# EAGLE design Controller Board v7 (EAGLE 5.06)
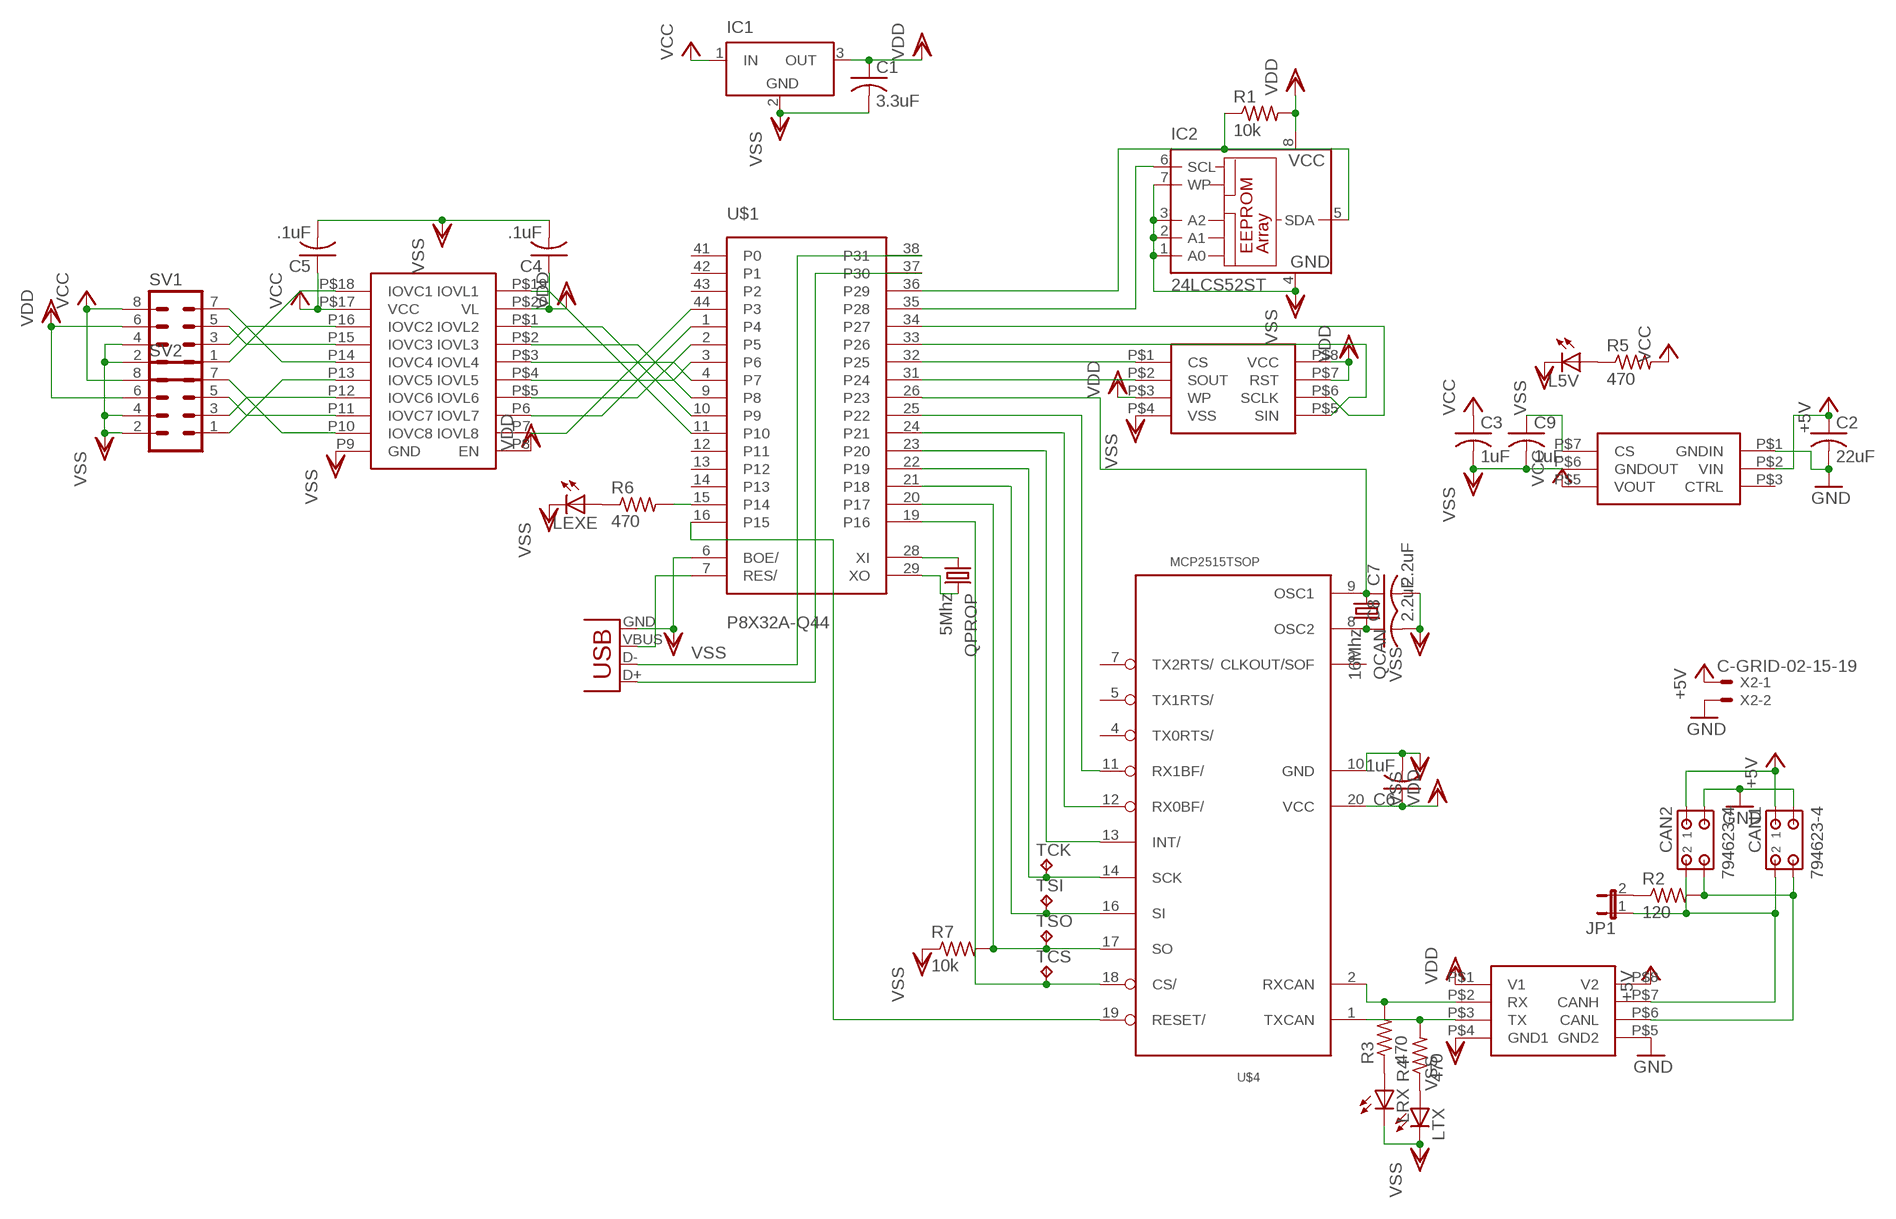
[diagram p0: schematic, sheet 1]

## Parts
C1  3.3uF  C-USC0805  [C0805]
C2  22uF  C-USC1210  [C1210]
C3  1uF  C-USC1210  [C1210]
C4  .1uF  C-USC0805  [C0805]
C5  .1uF  C-USC0805  [C0805]
C6  1uF  C-USC0805  [C0805]
C7  2.2uF  C-USC0805  [C0805]
C8  2.2uF  C-USC0805  [C0805]
C9  1uF  C-USC1210  [C1210]
CAN1  794623-4  [794623-4]
CAN2  794623-4  [794623-4]
IC1  LT1129CST5  [SOT223]
IC2  24LCS52ST  [TSSOP8]
JP1  JP1E  [JP1]
L5V  LEDCHIP-LED0805  [CHIP-LED0805]
LEXE  LEDCHIP-LED0805  [CHIP-LED0805]
LRX  LEDCHIP-LED0805  [CHIP-LED0805]
LTX  LEDCHIP-LED0805  [CHIP-LED0805]
QCAN  16Mhz  CRYSTALHC49UP  [HC49UP]
QPROP  5Mhz  CRYSTALHC49UP  [HC49UP]
R1  10k  R-US_R0603  [R0603]
R2  120  R-US_R0603  [R0603]
R3  470  R-US_R0603  [R0603]
R4  470  R-US_R0603  [R0603]
R5  470  R-US_R0603  [R0603]
R6  470  R-US_R0603  [R0603]
R7  10k  R-US_R0603  [R0603]
SV1  MA04-2  [MA04-2]
SV2  MA04-2  [MA04-2]
TCK  TPPAD1-13  [P1-13]
TCS  TPPAD1-13  [P1-13]
TSI  TPPAD1-13  [P1-13]
TSO  TPPAD1-13  [P1-13]
U$1  P8X32A-Q44  [P8X32A-Q44]
U$2  VINF-VWRBS2  [VINF-VWRBS2]
U$3  TI-ISO1050  [DUB-8]
U$4  MCP2515TSOP  [TSSOP20]
U$5  M25PE20  [S08N]
U$6  MAX3000E  [TQFN-20]
X1  USBSMD  [USB-MINIB]
X2  C-GRID-02-15-19  [15-91-02]

## Nets
+5V: C2.1 CAN1.1 CAN2.1 U$2.P$2(VIN) U$3.P$8(V2) X2.1
FLASHCLK: U$1.34(P27) U$5.P$6(SCLK)
FLASHSIN: U$1.33(P26) U$5.P$5(SIN)
GND: C2.2 CAN1.3 CAN2.3 U$2.P$1(GNDIN) U$3.P$5(GND2) X2.2
N$1: QPROP.1 U$1.28(XI)
N$2: QPROP.2 U$1.29(XO)
N$3: IC2.6(SCL) U$1.35(P28)
N$4: IC2.5(SDA) R1.1 U$1.36(P29)
N$5: U$1.7(RES/) X1.VBUS
N$6: U$1.38(P31) X1.D-
N$7: U$1.37(P30) X1.D+
N$8: U$1.25(P22) U$4.11(RX1BF/)
N$9: U$1.24(P21) U$4.12(RX0BF/)
N$10: CAN1.4 CAN2.4 R2.2 U$3.P$6(CANL)
N$11: CAN1.2 CAN2.2 JP1.1 U$3.P$7(CANH)
N$12: R6.2 U$1.15(P14)
N$13: C9.1 U$2.P$7(CS)
N$14: U$1.32(P25) U$5.P$1(CS)
N$15: U$1.31(P24) U$5.P$2(SOUT)
N$16: U$1.23(P20) U$4.13(INT/)
N$17: TCK.1(TP) U$1.22(P19) U$4.14(SCK)
N$18: C7.1 QCAN.1 U$1.26(P23) U$4.9(OSC1)
N$19: C8.1 QCAN.2 U$4.8(OSC2)
N$20: R3.2 U$3.P$2(RX) U$4.2(RXCAN)
N$21: R4.2 U$3.P$3(TX) U$4.1(TXCAN)
N$22: JP1.2 R2.1
N$23: TSI.1(TP) U$1.21(P18) U$4.16(SI)
N$24: TCS.1(TP) U$1.19(P16) U$4.18(CS/)
N$25: U$1.16(P15) U$4.19(RESET/)
N$26: LRX.A R3.1
N$27: U$1.11(P10) U$6.P$19(IOVL1)
N$28: SV2.7 U$6.P10(IOVC8)
N$29: SV2.5 U$6.P11(IOVC7)
N$30: U$1.10(P9) U$6.P$1(IOVL2)
N$31: U$1.9(P8) U$6.P$2(IOVL3)
N$32: U$1.4(P7) U$6.P$3(IOVL4)
N$33: U$1.3(P6) U$6.P$4(IOVL5)
N$34: U$1.2(P5) U$6.P$5(IOVL6)
N$35: U$1.1(P4) U$6.P6(IOVL7)
N$36: U$1.44(P3) U$6.P7(IOVL8)
N$37: SV2.3 U$6.P12(IOVC6)
N$38: SV2.1 U$6.P13(IOVC5)
N$39: SV1.7 U$6.P14(IOVC4)
N$40: SV1.1 U$6.P$18(IOVC1)
N$41: SV1.3 U$6.P16(IOVC2)
N$42: SV1.5 U$6.P15(IOVC3)
N$44: R7.2 TSO.1(TP) U$1.20(P17) U$4.17(SO)
N$46: LTX.A R4.1
N$47: L5V.A R5.1
N$48: LEXE.A R6.1
VCC: C3.1 C5.1 IC1.1(IN) R5.2 SV1.8 SV2.8 U$2.P$5(VOUT) U$6.P$17(VCC)
VDD: C1.1 C4.1 C6.1 IC1.3(OUT) IC2.8(VCC) R1.2 SV1.6 SV2.6 U$3.P$1(V1) U$4.20(VCC) U$5.P$3(WP) U$5.P$7(RST) U$5.P$8(VCC) U$6.P8(EN) U$6.P$20(VL)
VSS: C1.2 C3.2 C4.2 C5.2 C6.2 C7.2 C8.2 C9.2 IC1.2(GND) IC2.1(A0) IC2.2(A1) IC2.3(A2) IC2.4(GND) IC2.7(WP) L5V.C LEXE.C LRX.C LTX.C R7.1 SV1.2 SV1.4 SV2.2 SV2.4 U$1.6(BOE/) U$2.P$6(GNDOUT) U$3.P$4(GND1) U$4.10(GND) U$5.P$4(VSS) U$6.P9(GND) X1.GND
Unconnected: U$1.12(P11) U$1.13(P12) U$1.14(P13) U$1.41(P0) U$1.42(P1) U$1.43(P2) U$2.P$3(CTRL) U$4.3(CLKOUT/SOF) U$4.4(TX0RTS/) U$4.5(TX1RTS/) U$4.7(TX2RTS/)

## Power pins joined to a net without a drawn wire
VDD: U$1.8(VDD) U$1.18(VDD) U$1.30(VDD) U$1.40(VDD)
VSS: IC1.4(GND) U$1.5(VSS) U$1.17(VSS) U$1.27(VSS) U$1.39(VSS)

## Library data of the parts
C1-C9 = rcl:C-US: CAPACITOR, American symbol
CAN1 CAN2 = con-amp:794623-4: MICRO MATE N LOK Dual Row, grid 1.5 mm Source: http://catalog.tycoelectronics.com .. ENG_CD_794623_F.pdf
IC1 = linear-technology:LT1129CST5: VOLTAGE REGULATOR with shutdown
IC2 = microchip:24*: Serial EEPROM I2C
JP1 = jumper:JP1E: JUMPER
L5V LEXE LRX LTX = led:LED: LED OSRAM: - CHIPLED LG R971, LG N971, LY N971, LG Q971, LY Q971, LO R971, LY R971 LH N974, LH R974 LS Q976, LO Q976, LY Q976 LO Q996 - Hyper CHIPLED LW Q18S LB Q993, LB Q99A, LB R99A - SideLED LS A670, LO A670, LY A670, LG A670, LP A670 LB A673, LV A673, LT A673, LW A673 LH A674 LY A675 LS A676, LA A676, LO A676, LY A676, LW A676 LS A679, LY A679, LG A679 - Hyper Micro SIDELED® LS Y876, LA Y876, LO Y876, LY Y876 LT Y87S - SmartLED LW L88C, LW L88S LB L89C, LB L89S, LG L890 LS L89K, LO L89K, LY L89K LS L896, LA L896, LO L896, LY L896 - TOPLED LS T670, LO T670, LY T670, LG T670, LP T670 LSG T670, LSP T670, LSY T670, LOP T670, LYG T670 LG T671, LOG T671, LSG T671 LB T673, LV T673, LT T673, LW T673 LH T674 LS T676, LA T676, LO T676, LY T676, LB T676, LH T676, LSB T676, LW T676 LB T67C, LV T67C, LT T67C, LS T67K, LO T67K, LY T67K, LW E67C LS E67B, LA E67B, LO E67B, LY E67B, LB E67C, LV E67C, LT E67C LW T67C LS T679, LY T679, LG T679 LS T770, LO T770, LY T770, LG T770, LP T770 LB T773, LV T773, LT T773, LW T773 LH T774 LS E675, LA E675, LY E675, LS T675 LS T776, LA T776, LO T776, LY T776, LB T776 LHGB T686 LT T68C, LB T68C - Hyper Mini TOPLED® LB M676 - Mini TOPLED Santana® LG M470 LS M47K, LO M47K, LY M47K Source: http://www.osram.convergy.de LUXEON: - LUMILED® LXK2-PW12-R00, LXK2-PW12-S00, LXK2-PW14-U00, LXK2-PW14-V00 LXK2-PM12-R00, LXK2-PM12-S00, LXK2-PM14-U00 LXK2-PE12-Q00, LXK2-PE12-R00, LXK2-PE12-S00, LXK2-PE14-T00, LXK2-PE14-U00 LXK2-PB12-K00, LXK2-PB12-L00, LXK2-PB12-M00, LXK2-PB14-N00, LXK2-PB14-P00, LXK2-PB14-Q00 LXK2-PR12-L00, LXK2-PR12-M00, LXK2-PR14-Q00, LXK2-PR14-R00 LXK2-PD12-Q00, LXK2-PD12-R00, LXK2-PD12-S00 LXK2-PH12-R00, LXK2-PH12-S00 LXK2-PL12-P00, LXK2-PL12-Q00, LXK2-PL12-R00 Source: www.luxeon.com KINGBRIGHT: KA-3528ASYC Source: www.kingbright.com
QCAN QPROP = crystal:CRYSTAL: CRYSTAL
R1-R7 = rcl:R-US_: RESISTOR, American symbol
SV1 SV2 = con-lstb:MA04-2: PIN HEADER
TCK TCS TSI TSO = testpad:TP: Test pad
U$1 = parallax_propeller:P8X32A-Q44
U$2 = dc-dc-converter:VINF-VWRBS2
U$3 = isodcdc:TI-ISO1050
U$4 = MCP2515_MT:MCP2515*: MCP2515 Standalone CAN-Controller by Microchip Eagle-Lib. by MartinThomas
U$5 = Flash:M25PE20
U$6 = Level Shifters:MAX3000E
X1 = SparkFun:USB: USB Connectors USB-B-PTH is fully proven SKU : PRT-00139 USB-miniB is fully proven SKU : PRT-00587 USB-A-PCB is untested. USB-A-H is throughly reviewed, but untested. Spark Fun Electronics SKU : PRT-00437 USB-B-SMT is throughly reviewed, but untested. Needs silkscreen touching up. USB-A-S has not been used/tested USB-MB-H has not been used/tested
X2 = con-molex:C-GRID-02: CONNECTOR wire to board 2.54 mm (0.100") pitch header

## Board
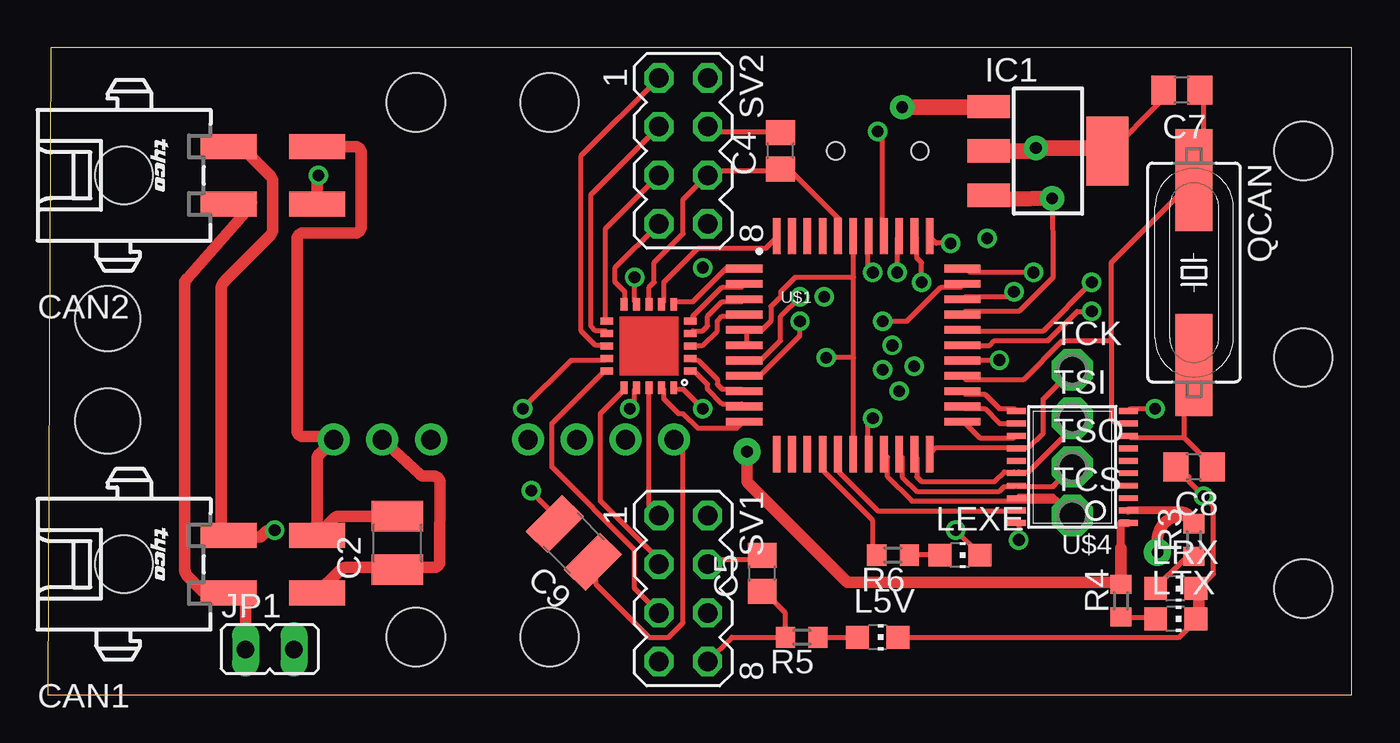
[diagram p1: board, top side]
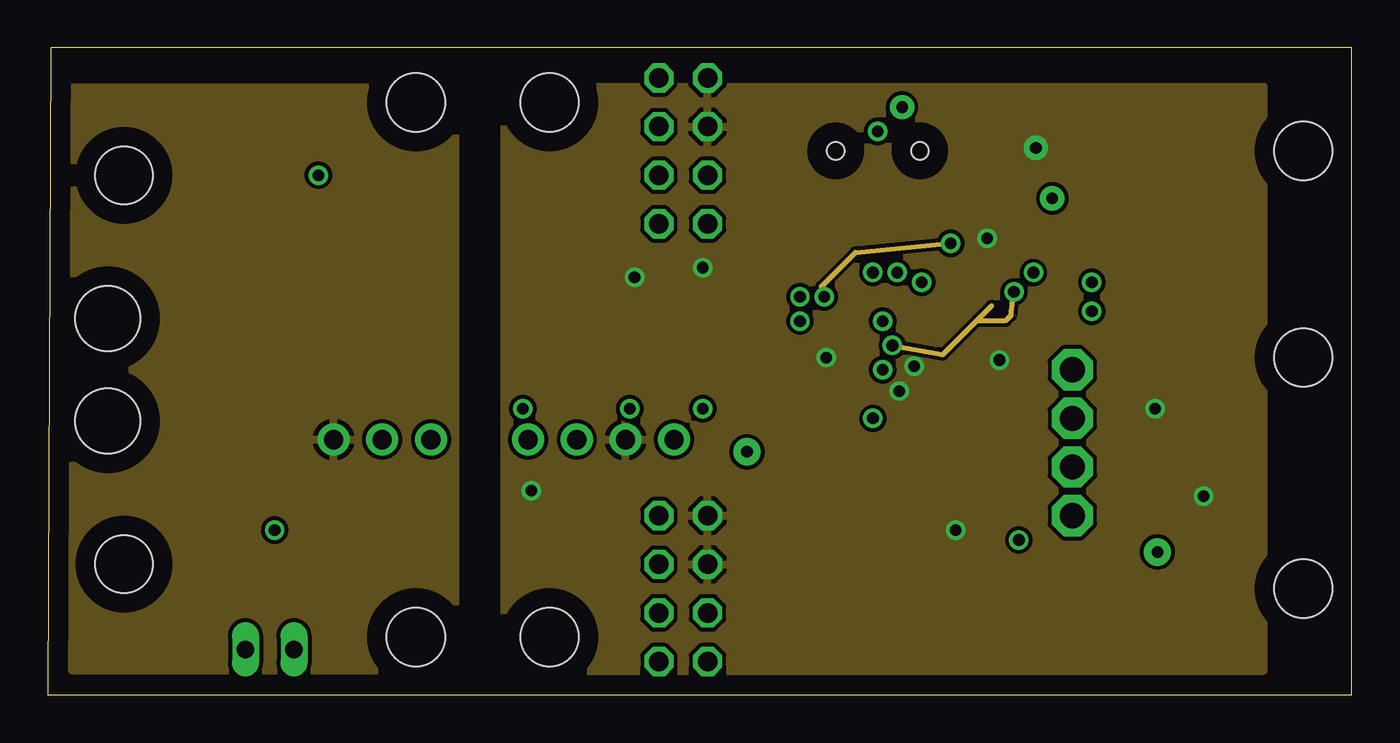
[diagram p2: board, inner layer Route2]
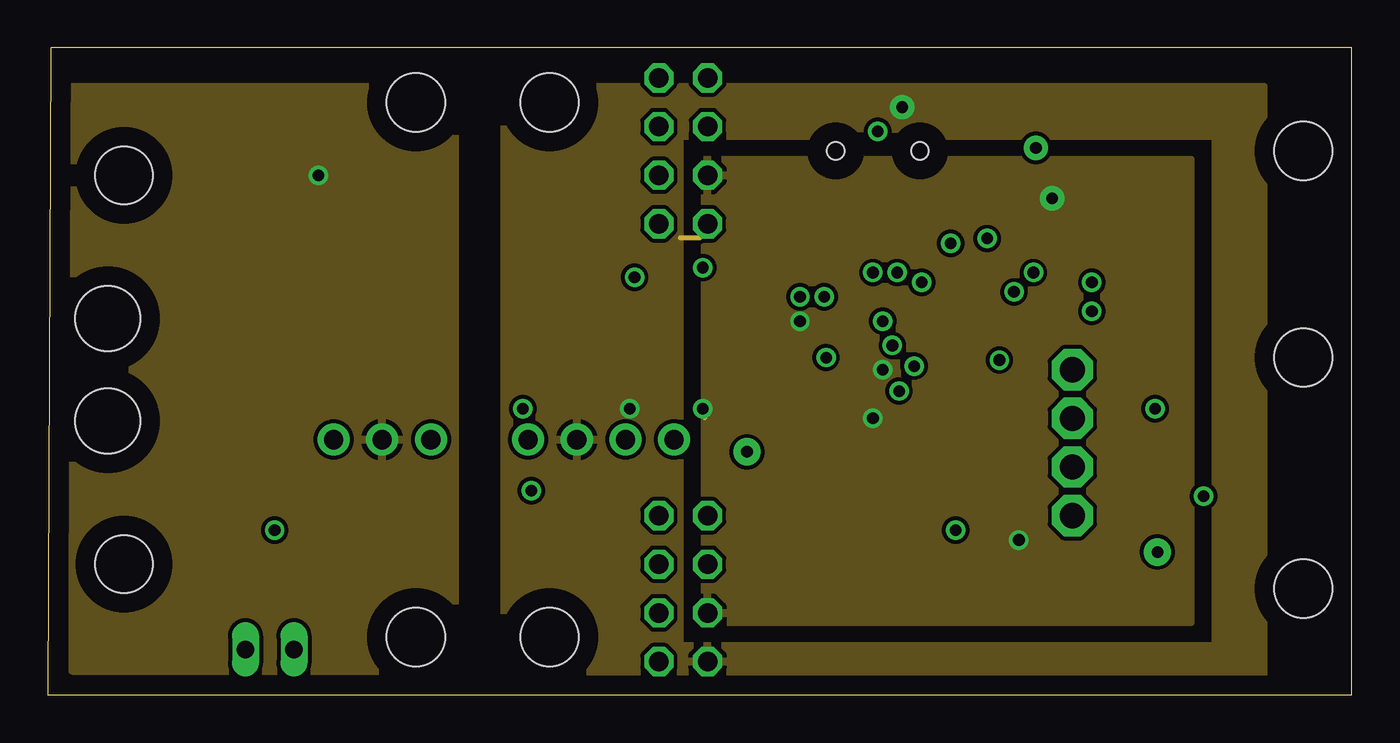
[diagram p3: board, inner layer Route15]
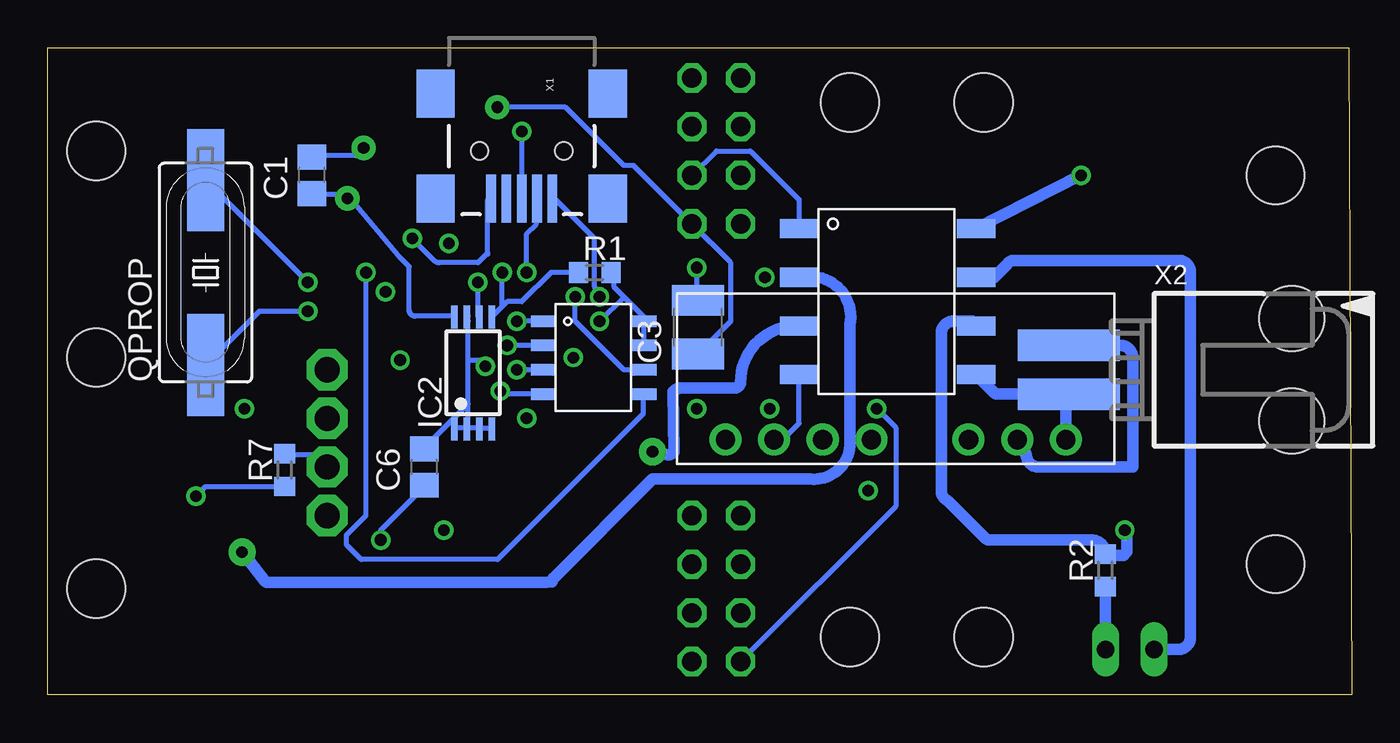
[diagram p4: board, bottom side, seen from below]

Size 68.08 x 33.8 mm. Coordinates in mm from the lower left corner, seen from the top.
Outline: 0,0 68.08,0 68.08,33.8 0.16,33.8 0,0
Copper layers (1*2+15*16): Top 0.035mm / dielectric 0.2mm / Route2 0.035mm / dielectric 1.5mm / Route15 0.035mm / dielectric 0.2mm / Bottom 0.035mm
Design rules "4 layer": minimum track width 10mil, minimum drill 24mil, track to track 8mil, track to pad 8mil, pad to pad 8mil, via to via 8mil, smd to smd 8mil, copper to edge 40mil, drill to drill 8mil, minimum pad ring 10mil, minimum via ring 8mil, stop-mask expansion 4mil, vias tented up to drill 0mil, thermal gap 10mil
Holes 3.05 mm at 65.56,5.56 65.56,28.42 26.19,30.96 26.19,3.02 65.56,17.62 19.21,30.96 19.21,3.02
tRestrict: area 22.4,4.3 to 23,30.3

### Footprints (pad centres in the part's own frame; a part is rotated, then mirrored left to right if it is on the bottom)
C0805 = smd 1.3 x 1.5: 1 -0.95,0; 2 0.95,0
C1210 = smd 1.6 x 2.7: 1 -1.4,0; 2 1.4,0
794623-4 = smd 1.3 x 2.92: 1 1.5,10.1; 2 1.5,5.48; 3 -1.5,10.1; 4 -1.5,5.48 | hole 3: 0,0
SOT223 = smd 1.219 x 2.235: 1 -2.311,-3.099; 2 0,-3.099; 3 2.311,-3.099 | smd 3.6 x 2.2: 4 0,3.099
TSSOP8 = smd 0.35 x 1.2: 1 -0.975,-2.925; 2 -0.325,-2.925; 3 0.325,-2.925; 4 0.975,-2.925; 5 0.975,2.925; 6 0.325,2.925; 7 -0.325,2.925; 8 -0.975,2.925
JP1 = drill 0.914 long: 1 0,-1.27; 2 0,1.27
CHIP-LED0805 = smd 1.2 x 1.2: A 0,-1.05; C 0,1.05
HC49UP = smd 5.334 x 1.93: 1 -4.826,0; 2 4.826,0
R0603 = smd 1 x 1.1: 1 -0.85,0; 2 0.85,0
MA04-2 = drill 1.016 octagon: 1 -3.81,-1.27; 2 -3.81,1.27; 3 -1.27,-1.27; 4 -1.27,1.27; 5 1.27,-1.27; 6 1.27,1.27; 7 3.81,-1.27; 8 3.81,1.27
P1-13 = drill 1.321 pad 2.159 octagon: 1 0,0
P8X32A-Q44 = smd 1.9 x 0.4: 1 -5.713,4.013; 2 -5.713,3.212; 3 -5.713,2.413; 4 -5.713,1.613; 5 -5.713,0.812; 6 -5.713,0.013; 7 -5.713,-0.787; 8 -5.713,-1.587; 9 -5.713,-2.388; 10 -5.713,-3.188; 11 -5.713,-3.987; 23 5.688,-3.987; 24 5.688,-3.188; 25 5.688,-2.388; 26 5.688,-1.587; 27 5.688,-0.787; 28 5.688,0.013; 29 5.688,0.812; 30 5.688,1.613; 31 5.688,2.413; 32 5.688,3.212; 33 5.688,4.013 | smd 0.4 x 1.9: 12 -4.013,-5.688; 13 -3.212,-5.688; 14 -2.413,-5.688; 15 -1.613,-5.688; 16 -0.812,-5.688; 17 -0.013,-5.688; 18 0.787,-5.688; 19 1.587,-5.688; 20 2.388,-5.688; 21 3.188,-5.688; 22 3.987,-5.688; 34 3.987,5.713; 35 3.188,5.713; 36 2.388,5.713; 37 1.587,5.713; 38 0.787,5.713; 39 -0.013,5.713; 40 -0.812,5.713; 41 -1.613,5.713; 42 -2.413,5.713; 43 -3.212,5.713; 44 -4.013,5.713
VINF-VWRBS2 = drill 1 pad 1.676 round: P$1 -12.7,5.08; P$2 -10.16,5.08; P$3 -7.62,5.08; P$4 -2.54,5.08; P$5 0,5.08; P$6 2.54,5.08; P$7 5.08,5.08
DUB-8 = smd 2 x 1: P$1 -4.572,3.556; P$2 -4.572,1.016; P$3 -4.572,-1.524; P$4 -4.572,-4.064; P$5 4.678,-4.064; P$6 4.678,-1.524; P$7 4.678,1.016; P$8 4.678,3.556
TSSOP20 = smd 0.305 x 0.991: 1 -2.925,-2.918; 2 -2.275,-2.918; 3 -1.625,-2.918; 4 -0.975,-2.918; 5 -0.325,-2.918; 6 0.325,-2.918; 7 0.975,-2.918; 8 1.625,-2.918; 9 2.275,-2.918; 10 2.925,-2.918; 11 2.925,2.918; 12 2.275,2.918; 13 1.625,2.918; 14 0.975,2.918; 15 0.325,2.918; 16 -0.325,2.918; 17 -0.975,2.918; 18 -1.625,2.918; 19 -2.275,2.918; 20 -2.925,2.918
S08N = smd 0.6 x 1.3: P$1 -2.54,-2.667; P$2 -1.27,-2.667; P$3 0,-2.667; P$4 1.27,-2.667; P$5 1.27,2.587; P$6 0,2.587; P$7 -1.27,2.587; P$8 -2.54,2.587
TQFN-20 = smd 0.65 x 0.35: P6 0.875,-1.1; P7 0.875,-0.45; P8 0.875,0.2; P9 0.875,0.85; P10 0.875,1.5; P16 -3.475,1.5; P$17 -3.475,0.85; P$18 -3.475,0.2; P$19 -3.475,-0.45; P$20 -3.475,-1.1 | smd 0.35 x 0.65: P11 0,2.4; P12 -0.65,2.4; P13 -1.3,2.4; P14 -1.95,2.4; P15 -2.6,2.4; P$1 -2.6,-1.95; P$2 -1.95,-1.95; P$3 -1.3,-1.95; P$4 -0.65,-1.95; P$5 0,-1.95
USB-MINIB = smd 2.5 x 0.5: D+ 2.5,0; D- 2.5,0.8; GND 2.5,-1.6; ID 2.5,-0.8; VBUS 2.5,1.6 | smd 2.5 x 2: GND@1 -3,-4.5; GND@2 -3,4.5; GND@3 2.5,4.5; GND@4 2.5,-4.5 | hole 0.9: 0,2.2; 0,-2.2
15-91-02 = smd 1.651 x 5.334: 1 -1.27,-10.795; 2 1.27,-10.795 | hole 3.404: -2.667,0.838; 2.667,0.838

### Placement (x,y rotation side)
C1  54.29,27.15 90 bottom
C2  18.26,7.94 90 top
C3  34.13,19.21 90 bottom
C4  38.26,28.42 90 top
C5  37.31,6.35 90 top
C6  48.42,11.91 90 bottom
C7  59.21,31.59 180 top
C8  59.85,11.91 180 top
C9  27.46,7.94 135 top
CAN1  3.97,6.83 270 top
CAN2  3.97,27.15 270 top
IC1  52.23,28.42 270 top
IC2  45.88,16.83 0 bottom
JP1  11.59,2.38 270 top
L5V  43.34,3.02 270 top
LEXE  47.62,7.3 270 top
LRX  58.9,5.56 270 top
LTX  58.9,3.97 270 top
QCAN  59.85,22.07 270 top
QPROP  59.85,22.07 90 bottom
R1  39.53,22.07 0 bottom
R2  12.86,6.51 90 bottom
R3  59.85,8.1 90 top
R4  56.04,4.92 90 top
R5  39.37,3.02 180 top
R6  44.13,7.3 180 top
R7  55.72,11.75 90 bottom
SV1  33.18,5.56 270 top
SV2  33.18,28.42 270 top
TCK  53.5,16.99 0 top
TCS  53.5,9.37 0 top
TSI  53.5,14.45 0 top
TSO  53.5,11.91 0 top
U$1  42.07,18.26 0 top
U$2  27.62,18.42 180 bottom
U$3  24.29,20.8 0 bottom
U$4  53.5,11.91 90 top
U$5  39.53,16.99 270 bottom
U$6  31.59,19.53 90 top
X1  43.34,28.42 270 bottom
X2  3.97,16.99 270 bottom

### Tracks (layer width: path | path; a pad name or v marks a point on that pad's centre or on a via)
+5V  (via drill 0.61)
  Top 0.254: CAN2.1 14.13,25.88 | C2.1 18.19,6.57 18.19,6.67
  Top 0.61: v14.13,27.15 14.07,27.09 CAN2.1 | CAN1.1 15.22,6.48 arc-45 15.67,6.67 | 15.67,6.67 18.19,6.67 19.25,6.67 arc45 19.13,6.75 arc-45 18.95,6.93 18.77,6.95 | 15.67,6.67 20.15,6.67 arc92 20.47,7 20.49,11.12 arc88 20.01,11.43 19.65,11.43 arc-43 19.43,11.51 U$2.P$2
  Bottom 0.61: v14.13,27.15 U$3.P$8 | X2.1 12.06,18.26 arc90 11.43,17.62 11.43,11.91 16.35,11.91 arc90 16.99,12.54 U$2.P$2
  pour Route15: 1.27,31.75 1.27,1.27 21.27,1.27 21.27,31.75
FLASHCLK  (via drill 0.61)
  Top 0.254: v47.15,23.59 46.39,23.59 46.13,23.84 U$1.34
  Route2 0.254: v40.54,20.8 40.39,21.34 42.16,23.11 v47.15,23.59
  Bottom 0.254: v40.54,20.8 40.54,19.53 38,16.99 U$5.P$6
FLASHSIN  (via drill 0.61)
  Top 0.254: v51.47,22.07 48.16,22.07 47.91,22.32 U$1.33
  Bottom 0.254: v51.47,22.07 51.47,9.37 52.48,8.35 52.48,7.84 51.72,7.08 44.61,7.08 36.99,14.7 36.99,15.72 U$5.P$5
GND
  Top 0.61: C2.2 15.21,9.34 arc45 14.99,9.24 CAN1.3 14.07,12.35 arc-45 14.16,12.57 U$2.P$1 arc90 14.76,13.49 13.33,13.49 arc-90 13.02,13.81 13.02,23.81 arc-90 13.33,24.13 16.03,24.13 arc90 16.35,24.45 16.35,28.33 arc90 16.03,28.65 CAN2.3
  Bottom 0.61: U$2.P$1 14.92,15.56 arc90 X2.2 18.46,15.72 arc45 18.69,15.81 U$3.P$5
  pour Route2: 21.27,31.75 21.27,1.27 1.27,1.27 1.27,31.75
N$1  (via drill 0.61)
  Top 0.254: v54.51,20.03 53.75,20.03 52.23,18.51 49.43,18.51 49.18,18.26 47.91,18.26 U$1.28
  Bottom 0.254: v54.51,20.03 57.05,20.03 QPROP.1
N$2  (via drill 0.61)
  Top 0.254: v54.51,21.56 51.97,19.02 47.91,19.02 U$1.29
  Bottom 0.254: v54.51,21.56 QPROP.2
N$3  (via drill 0.61)
  Top 0.254: v45.62,21.56 45.62,22.57 45.37,22.83 45.37,23.84 U$1.35
  Bottom 0.254: v45.62,21.56 45.62,19.78 IC2.6
N$4  (via drill 0.61)
  Top 0.254: v44.35,22.07 44.35,23.84 U$1.36
  Bottom 0.254: 44.35,20.29 44.86,19.78 IC2.5 | 44.35,20.29 44.1,20.54 43.34,20.54 41.81,22.07 R1.1 | 44.35,20.29 v44.35,22.07
N$5  (via drill 0.61)
  Top 0.254: v39.27,20.8 38.26,19.78 38.26,18.51 37.24,17.49 36.48,17.49 U$1.7
  Bottom 0.254: v39.27,20.8 39.27,21.05 39.53,21.3 39.53,23.84 41.56,25.88 X1.VBUS
N$6  (via drill 0.61)
  Top 0.254: v43.08,22.07 42.83,22.32 42.83,23.84 U$1.38
  Bottom 0.254: v43.08,22.07 43.08,24.1 42.58,24.61 42.58,25.88 X1.D-
N$7  (via drill 0.61)
  Top 0.254: v43.34,29.43 43.59,29.18 43.59,24.1 U$1.37
  Bottom 0.254: v43.34,29.43 X1.D+
N$8
  Top 0.254: U$4.11 50.45,14.95 49.69,14.95 48.93,15.72 47.91,15.72 U$1.25
N$9
  Top 0.254: U$1.24 47.91,14.95 48.93,14.95 49.69,14.19 50.45,14.19 U$4.12
N$10  (via drill 0.61)
  Top 0.254: CAN2.4 9.56,28.42 | 9.56,8.35 9.56,8.6 CAN1.4 9.56,8.35
  Top 0.61: 9.56,8.6 9.18,8.6 9.05,8.73 9.05,21.17 arc-45 9.23,21.62 11.56,23.94 arc45 11.75,24.39 11.75,26.73 arc45 11.56,27.17 10.09,28.65 CAN2.4 | v11.84,8.6 11.75,8.57 11.43,8.57 11.11,8.26 9.52,8.26 CAN1.4
  Bottom 0.61: v11.84,8.6 11.75,8.57 11.75,7.46 11.91,7.3 12.7,7.3 R2.2 arc-90 13.6,8.1 18.95,8.1 arc45 19.24,8.28 21.09,10.13 arc45 21.43,10.58 21.43,18.89 arc90 20.8,19.53 19.84,19.53 arc90 19.61,19.29 U$3.P$6
N$11
  Top 0.254: CAN1.2 9.56,5.56 | CAN1.2 9.56,5.3 | JP1.1 10.32,2.51 | CAN2.2 9.3,25.62 | CAN1.2 9.3,5.56
  Top 0.61: CAN2.2 9.52,25.72 10.64,25.72 10.48,25.4 7.3,21.77 arc18 7.14,21.59 7.14,20.8 7.14,6.61 arc45 7.33,6.16 8.1,5.4 9.37,5.4 CAN1.2 9.68,5.4 10.16,5.4 10.32,5.24 JP1.1
  Bottom 0.61: U$3.P$7 19.53,21.75 18.73,21.75 17.97,22.52 arc45 17.68,22.7 9.05,22.7 arc90 8.41,22.07 8.41,3.02 arc90 9.05,2.38 JP1.1
N$12
  Top 0.254: R6.2 43.08,7.33 43.08,9.11 40.54,11.65 40.54,12.41 U$1.15
N$13
  Top 0.254: 28.1,7.33 C9.1 28.61,6.83 28.61,5.81 31.4,3.02 32.42,3.02 33.18,3.78 33.18,12.92 32.92,13.18 U$2.P$7
N$14  (via drill 0.61)
  Top 0.254: v43.59,19.53 44.86,19.53 46.64,21.3 47.66,21.3 U$1.32
  Bottom 0.254: U$5.P$1 v43.59,19.53
N$15  (via drill 0.61)
  Top 0.254: v50.45,21.05 50.2,20.8 47.91,20.8 U$1.31
  Route2 0.254: v44.1,18.26 46.74,17.78 48.51,19.56 | 48.51,19.56 49.28,20.32 | v50.45,21.05 50.29,19.81 50.04,19.56 48.51,19.56
  Bottom 0.254: U$5.P$2 v44.1,18.26
N$16
  Top 0.254: U$4.13 50.45,13.43 48.67,13.43 47.91,14.19 U$1.23
N$17
  Top 0.254: U$1.22 46.13,12.67 46.39,12.92 50.45,12.92 U$4.14 50.7,12.92 51.21,12.92 51.97,13.68 51.97,15.46 TCK.1 | TCK.1
N$18
  Top 0.254: 55.53,18.51 55.53,22.57 QCAN.1 60.36,27.4 | 55.53,18.51 55.53,14.45 55.78,14.19 56.29,14.19 U$4.9 | 60.36,27.4 60.61,27.65 | 55.53,18.51 52.99,18.51 50.96,16.48 47.91,16.48 U$1.26 | 60.36,27.4 60.36,31.46 C7.1
N$19
  Top 0.254: 59.34,13.43 56.55,13.43 U$4.8 | 59.34,13.43 60.86,11.91 C8.1 | 59.34,13.43 59.34,16.73 QCAN.2
N$20  (via drill 0.61 pad 1.42)
  Top 0.406: U$4.2 59.16,9.63 arc-90 R3.2
  Top 0.61: R3.2 arc90 60.06,8.73 | R3.2 59.85,8.73 | v57.94,7.46 57.94,8.1 arc-90 59.21,9.37 59.43,9.37 arc-90 R3.2
  Bottom 0.61: U$3.P$2 27.84,21.81 arc90 26.19,19.37 26.19,13.02 arc90 28.26,11.27 36.51,11.27 41.66,6.13 arc-45 41.75,5.9 42.05,5.88 arc5 42.08,5.87 56.54,5.87 arc45 56.77,5.97 v57.94,7.46
N$21  (via drill 0.61 pad 1.42)
  Top 0.406: 56.04,7.68 56.04,8.98 U$4.1
  Top 0.61: R4.2 56.04,5.56 | R4.2 56.04,7.68 | R4.2 R4.2 arc45 55.8,5.87 41.75,5.87 36.61,11.02 arc-45 36.51,11.24 v36.51,12.7
  Bottom 0.61: U$3.P$3 28.99,19.27 arc-90 31.91,16.35 arc90 32.23,16.03 34.98,16.03 arc-45 35.43,15.85 35.4,12.7 35.47,12.63 arc45 35.69,12.54 v36.51,12.7
N$22
  Bottom 0.61: JP1.2 R2.1
N$23
  Top 0.254: TSI.1 53.5,13.94 51.21,11.65 50.7,11.65 U$4.16 50.45,11.65 49.94,11.65 49.43,11.14 45.62,11.14 45.37,11.4 45.37,12.41 U$1.21
N$24
  Top 0.254: 52.74,10.13 52.48,10.38 50.7,10.38 U$4.18 | 52.74,10.13 45.12,10.13 43.85,11.4 43.85,12.41 U$1.19 | 52.74,10.13 TCS.1
N$25
  Top 0.254: U$4.19 50.45,9.62 43.34,9.62 41.31,11.65 41.31,12.41 U$1.16
N$26
  Top 0.254: R3.1 59.85,7.08 59.34,7.08 57.82,5.56 LRX.A
N$27
  Top 0.254: U$6.P$19 32.16,15.97 32.16,15.46 32.92,14.7 33.18,14.7 33.94,13.94 35.97,13.94 36.23,14.19 U$1.11
N$28
  Top 0.254: SV2.7 29.62,22.32 29.62,21.56 30.13,21.05 30.13,20.54 U$6.P10
N$29
  Top 0.254: SV2.5 29.11,24.35 29.11,19.53 U$6.P11
N$30
  Top 0.254: U$6.P$1 33.69,16.99 34.45,16.22 34.45,15.97 35.21,15.21 36.23,15.21 U$1.10
N$31
  Top 0.254: U$6.P$2 33.69,17.49 33.94,17.49 34.96,16.48 34.96,16.22 35.21,15.97 36.23,15.97 U$1.9
N$32
  Top 0.254: U$6.P$3 33.69,18.26 34.19,18.26 34.96,19.02 34.96,19.53 35.21,19.78 36.23,19.78 U$1.4
N$33
  Top 0.254: U$6.P$4 33.69,19.02 34.19,19.02 34.45,19.27 34.45,19.78 35.21,20.54 36.23,20.54 U$1.3
N$34
  Top 0.254: U$6.P$5 33.69,19.53 33.69,19.78 35.21,21.3 36.23,21.3 U$1.2
N$35
  Top 0.254: U$6.P6 32.67,20.54 33.69,20.54 35.46,22.32 36.23,22.32 U$1.1
N$36
  Top 0.254: U$6.P7 32.16,20.54 32.16,21.56 33.94,23.34 37.5,23.34 38,23.84 U$1.44
N$37
  Top 0.254: SV2.3 28.35,26.13 28.35,19.27 28.61,19.02 29.11,19.02 U$6.P12
N$38
  Top 0.254: SV2.1 27.84,28.16 27.84,19.02 28.61,18.26 29.11,18.26 U$6.P13
N$39  (via drill 0.61)
  Top 0.254: v24.8,14.95 27.34,17.49 29.11,17.49 U$6.P14
  Bottom 0.254: v24.8,14.95 23.78,13.94 23.78,9.87 SV1.7
N$40
  Top 0.254: SV1.1 31.4,9.87 31.4,15.97 U$6.P$18
N$41
  Top 0.254: SV1.3 31.91,7.08 28.86,10.13 28.86,14.7 30.13,15.97 U$6.P16
N$42
  Top 0.254: SV1.5 30.64,5.56 30.64,7.59 26.32,11.91 26.32,14.19 29.11,16.99 U$6.P15
N$44
  Top 0.254: TSO.1 52.48,10.89 50.7,10.89 U$4.17 50.45,10.89 49.94,10.89 49.69,10.64 45.37,10.64 44.61,11.4 44.61,12.41 U$1.20
  Bottom 0.254: TSO.1 54.13,12.54 55.56,12.54 R7.2
N$46
  Top 0.254: R4.1 56.04,4.03 57.82,4.03 LTX.A
N$47
  Top 0.254: R5.1 L5V.A
N$48
  Top 0.254: R6.1 45.12,7.33 46.39,7.33 LEXE.A
VCC  (via drill 0.61, 0.61 pad 1.27)
  Top 0.254: 48.93,30.7 IC1.1 | v30.38,14.95 30.64,15.21 30.64,15.97 U$6.P$17 | R5.2 38.51,4.29 37.5,5.3 C5.1 | R5.2 35.72,3.02 SV1.8 | R5.2
  Top 0.813: v44.61,30.7 48.93,30.7
  Route15 0.254: 33.02,23.88 34.04,23.88 SV2.8
  Bottom 0.254: v44.61,30.7 41.05,30.7 38,27.65 37.5,27.65 SV2.8 32.42,22.57 32.42,19.53 33.94,18 C3.1
  pour Route15: 23.81,31.75 23.81,0.32 63.5,0 63.5,2.54 33.02,2.54 33.02,31.75
  pour Route15: 33.02,31.75 33.02,29.21 60.96,29.21 60.96,1.27 63.5,1.27 63.5,31.75
  pour Route15: 23.81,2.54 23.81,0 63.5,0 63.5,2.54
VDD  (via drill 0.61, 0.61 pad 1.27)
  Top 0.254: 38.26,27.4 34.7,27.4 SV2.6 33.18,25.88 33.18,24.1 31.65,22.57 31.65,21.56 31.4,21.3 31.4,20.54 U$6.P8 | v43.08,14.45 42.83,14.19 42.83,12.67 U$1.18 | 38.26,27.4 38.77,27.4 41.31,24.86 41.31,24.1 U$1.40 | 38.26,27.4 C4.1 | v39.27,19.53 39.27,18.76 37.24,16.73 36.48,16.73 U$1.8 | v52.45,25.94 52.48,22.57 52.48,21.81 50.7,20.03 47.91,20.03 U$1.30 | 49.18,25.88 IC1.3 | v34.19,14.95 33.18,15.97 32.67,15.97 U$6.P$20 | v50.7,8.1 50.7,8.86 U$4.20
  Top 0.813: v52.45,25.94 49.18,25.88
  Route15 0.254: v34.19,14.95 34.29,14.48
  Bottom 0.254: U$5.P$7 36.99,18.26 36.99,19.53 U$5.P$8 36.73,19.53 38,20.8 | U$5.P$3 v43.59,16.99 | U$3.P$1 28.86,25.88 31.4,28.42 33.18,28.42 SV2.6 | 38,20.8 38.51,21.3 38.51,22.07 R1.2 | v39.27,19.53 38,20.8 | IC2.8 46.89,19.78 48.89,19.78 arc90 49.21,20.1 49.21,22.38 | v50.7,8.1 50.7,8.6 48.42,10.89 C6.1 | C1.1 54.26,26.13 52.48,26.13 v52.45,25.94 52.23,25.88 49.62,22.8 49.21,22.38 | 49.21,22.38 arc-67 49.21,22.38
  pour Route15: 34.29,27.94 34.29,3.81 59.69,3.81 59.69,27.94
VSS  (via drill 0.6, 0.61, 0.61 pad 1.27)
  Top 0.254: C8.2 59.09,11.91 59.59,11.4 59.59,11.14 v60.36,10.38 60.86,9.87 60.86,6.32 60.1,5.56 LRX.C | 42.07,21.81 42.07,23.84 U$1.39 | U$1.17 42.07,12.67 42.07,17.62 | 36.48,19.02 36.48,18.26 U$1.6 | v57.82,14.95 56.55,14.95 U$4.10 | v49.69,17.49 47.91,17.49 U$1.27 | 36.23,19.02 U$1.5 36.48,19.02 | 60.1,4.12 60.1,4.03 LTX.C 59.85,3.78 59.09,3.02 L5V.C | 36.48,19.02 37.24,19.02 37.75,19.53 37.75,20.29 38.26,20.8 38.26,21.05 39.02,21.81 42.07,21.81 | C7.2 58.07,31.46 58.07,30.96 55.53,28.42 IC1.4 55.28,28.42 55.02,28.16 | C5.2 37.24,7.08 34.7,7.08 SV1.4 | v30.64,21.81 30.64,20.54 U$6.P9 | 42.07,17.62 42.07,21.81 | 42.07,17.62 v40.64,17.62 | v25.24,10.67 25.24,10.64 26.67,9.21 26.51,9.05 C9.2 | SV2.4 34.7,29.43 38.26,29.43 C4.2 | v47.4,8.6 48.67,7.33 LEXE.C
  Top 0.61: 60.1,4.12 60.1,5.56
  Top 0.813: IC1.2 51.3,28.42 arc45 51.53,28.51 v51.59,28.57 55.04,28.57 arc-45 55.26,28.48 IC1.4
  Bottom 0.254: U$3.P$4 28.86,14.19 29.62,13.43 U$2.P$6 | v34.19,22.32 34.19,20.8 C3.2 | 45.62,13.94 44.86,13.94 IC2.4 | 45.62,13.94 46.13,13.94 | IC2.3 45.62,13.94 | 46.13,13.94 46.13,15.21 | 46.13,15.21 46.13,17.49 | 46.13,17.49 46.13,19.53 IC2.7 46.13,19.78 | 46.13,13.94 46.89,13.94 IC2.1 | 46.13,13.94 IC2.2 | 46.13,15.21 48.42,12.92 C6.2 | X1.GND 45.12,25.88 45.12,23.08 | U$5.P$4 44.16,15.72 arc45 44.38,15.81 v44.45,15.88 | 46.13,17.49 45.69,17.49 arc45 45.47,17.4 v45.24,17.18 | 45.12,23.08 45.12,23.02 | v60.36,10.38 59.85,10.89 55.78,10.89 R7.1 | 51.97,28.16 54.26,28.16 C1.2 | 51.97,28.16 51.72,28.42 v51.59,28.57 51.97,28.16 | 45.12,23.08 45.62,22.57 47.65,22.57 arc45 47.88,22.67 v49.05,23.84
  pour Route2: 23.81,31.75 23.81,1.27 63.5,1.27 63.5,31.75